# EAGLE design interface_dac_sma_feedback (EAGLE 7.2.0)
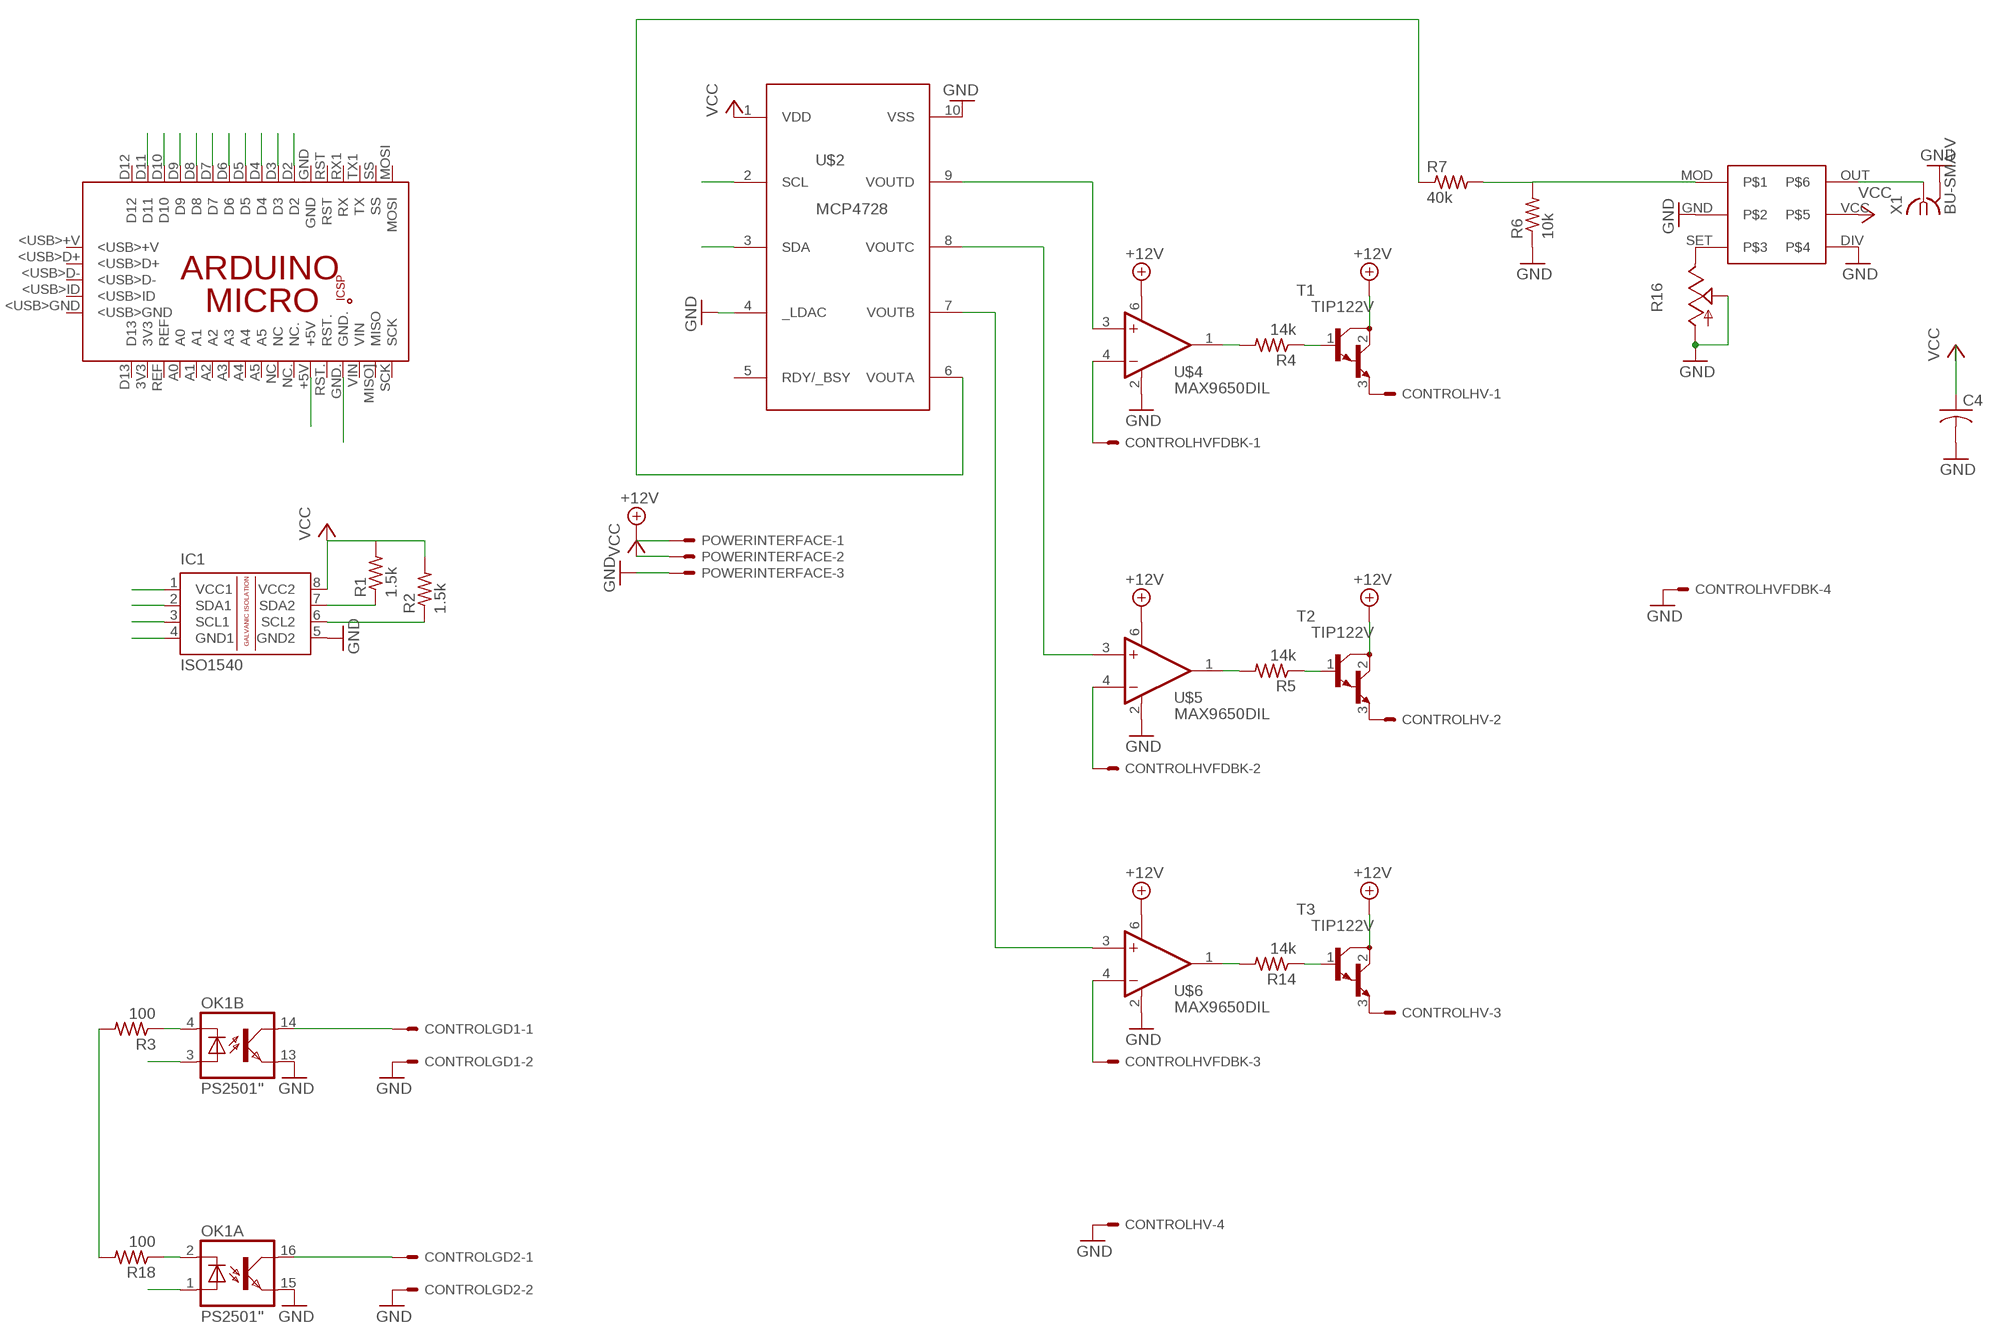
[diagram p0: schematic, sheet 1]

## Parts
C4  C-US075-063X106  [C075-063X106]
CONTROLGD1  KK-156-2  [KK-156-2]
CONTROLGD2  KK-156-2  [KK-156-2]
CONTROLHV  KK-156-4  [KK-156-4]
CONTROLHVFDBK  KK-156-4  [KK-156-4]
IC1  ISO1540  [DIL08]
OK1  PS2501"  [DIL16]
PCB1  ARDUINO_MICRO  [ARDUINO_MICRO]
POWERINTERFACE  KK-156-3  [KK-156-3]
R1  1.5k  R-US_0207/12  [0207/12]
R2  1.5k  R-US_0207/12  [0207/12]
R3  100  R-US_0207/12  [0207/12]
R4  14k  R-US_0207/12  [0207/12]
R5  14k  R-US_0207/12  [0207/12]
R6  10k  R-US_0207/12  [0207/12]
R7  40k  R-US_0207/12  [0207/12]
R14  14k  R-US_0207/12  [0207/12]
R16  TRIM_US-B90P  [SP19L]
R18  100  R-US_0207/12  [0207/12]
T1  TIP122V  [TO220V]
T2  TIP122V  [TO220V]
T3  TIP122V  [TO220V]
U$1  LTC6992  [DIL06]
U$2  MCP4728DIL  [DIL10]
U$4  MAX9650DIL  [DIL06-4]
U$5  MAX9650DIL  [DIL06-4]
U$6  MAX9650DIL  [DIL06-4]
X1  BU-SMA-V  [BU-SMA-V]

## Nets
+12V: POWERINTERFACE.1 T1.2(C) T2.2(C) T3.2(C) U$4.6(V+) U$5.6(V+) U$6.6(V+)
A+5: IC1.1(VCC1) PCB1.+5V
AGND: IC1.4(GND1) PCB1.GND. R3.2 R18.2
D4: PCB1.D4
D7: PCB1.D7
D8: PCB1.D8
D10: PCB1.D10
D11: PCB1.D11
ENSW1: CONTROLGD1.1 OK1.14(B:COL)
ENSW2: CONTROLGD2.1 OK1.16(A:COL)
GND: C4.2 CONTROLGD1.2 CONTROLGD2.2 CONTROLHV.4 CONTROLHVFDBK.4 IC1.5(GND2) OK1.13(B:EMI) OK1.15(A:EMI) POWERINTERFACE.3 R6.1 R16.A R16.S U$1.DIV U$1.GND U$2.4(_LDAC) U$2.10(VSS) U$4.2(V-) U$5.2(V-) U$6.2(V-) X1.2 X1.3 X1.4 X1.5
N$1: R7.1 U$2.6(VOUTA)
N$2: R6.2 R7.2 U$1.MOD
N$3: R4.1 T1.1(B)
N$4: CONTROLHV.1 T1.3(E)
N$5: R5.1 T2.1(B)
N$6: CONTROLHV.2 T2.3(E)
N$7: OK1.2(A:C) R18.1
N$8: CONTROLHVFDBK.1 U$4.4(-IN)
N$9: CONTROLHVFDBK.2 U$5.4(-IN)
N$10: OK1.4(B:C) R3.1
N$11: CONTROLHV.3 T3.3(E)
N$12: R16.E U$1.SET
N$13: U$1.OUT X1.1
N$14: CONTROLHVFDBK.3 U$6.4(-IN)
N$15: R14.1 T3.1(B)
N$16: U$2.9(VOUTD) U$4.3(+IN)
N$17: U$2.8(VOUTC) U$5.3(+IN)
N$18: U$2.7(VOUTB) U$6.3(+IN)
N$19: R4.2 U$4.1(OUT)
N$20: R5.2 U$5.1(OUT)
N$21: R14.2 U$6.1(OUT)
PWM5: PCB1.D5
PWM6: OK1.3(B:A) PCB1.D6
PWM9: OK1.1(A:A) PCB1.D9
SCL: IC1.3(SCL1) PCB1.D3
SCL_OUT: IC1.6(SCL2) R2.1 U$2.2(SCL)
SDA: IC1.2(SDA1) PCB1.D2
SDA_OUT: IC1.7(SDA2) R1.1 U$2.3(SDA)
VCC: C4.1 IC1.8(VCC2) POWERINTERFACE.2 R1.2 R2.2 U$1.VCC U$2.1(VDD)
Unconnected: OK1.5(C:A) OK1.6(C:C) OK1.7(D:A) OK1.8(D:C) OK1.9(D:EMI) OK1.10(D:COL) OK1.11(C:EMI) OK1.12(C:COL) PCB1.3V3 PCB1.5V PCB1.<USB>+V PCB1.<USB>D+ PCB1.<USB>D- PCB1.<USB>GND PCB1.<USB>ID PCB1.A0 PCB1.A1 PCB1.A2 PCB1.A3 PCB1.A4 PCB1.A5 PCB1.D12 PCB1.D13 PCB1.GND PCB1.GND_ PCB1.MISO. PCB1.MISO](MISO) PCB1.MOSI PCB1.MOSI. PCB1.NC PCB1.NC. PCB1.REF PCB1.RESET.. PCB1.RST PCB1.RST. PCB1.RX1(RX) PCB1.SCK PCB1.SCK. PCB1.SS PCB1.TX1(TX) PCB1.VIN U$2.5(RDY/_BSY)

## Library data of the parts
C4 = resistor:C-US: CAPACITOR, American symbol
CONTROLGD1 CONTROLGD2 = con-molex:KK-156-2: KK 156 HEADER Source: http://www.molex.com/pdm_docs/sd/026604100_sd.pdf; OC_FARNELL: unknown; OC_NEWARK: unknown
CONTROLHV CONTROLHVFDBK = con-molex:KK-156-4: KK 156 HEADER Source: http://www.molex.com/pdm_docs/sd/026604100_sd.pdf; OC_FARNELL: unknown; OC_NEWARK: unknown
IC1 = texas:ISO1540: ISOLATED CAN TRANSCEIVER Source: http://focus.ti.com/lit/ds/symlink/iso1050.pdf
OK1 = optocoupler:PS2501: SHARP OPTO COUPLER
PCB1 = E14_Arduino_published:ARDUINO_MICRO: Device for representing an Arduino Micro board with a footprint in an EAGLE design. Created by Dave Young for Element14. More EAGLE documentation at: http://www.element14.com/community/community/knode/cadsoft_eagle
POWERINTERFACE = con-molex:KK-156-3: KK 156 HEADER Source: http://www.molex.com/pdm_docs/sd/026604100_sd.pdf; OC_FARNELL: unknown; OC_NEWARK: unknown
R1 R2 R4-R7 R14 = resistor:R-US_: RESISTOR, American symbol
R3 R18 = rcl:R-US_: RESISTOR, American symbol
R16 = pot:TRIM_US-: POTENTIOMETER
T1-T3 = transistor-npn:TIP122*: NPN Darlington Transistor
U$1 = linear-technology:LTC6992
U$2 = microchip:MCP4728
U$4-U$6 = maxim:MAX9650
X1 = con-coax:BU-SMA-V: FEMALE SMA CONNECTOR Radiall distributor RS 112-3794; OC_FARNELL: unknown; OC_NEWARK: unknown

## Board
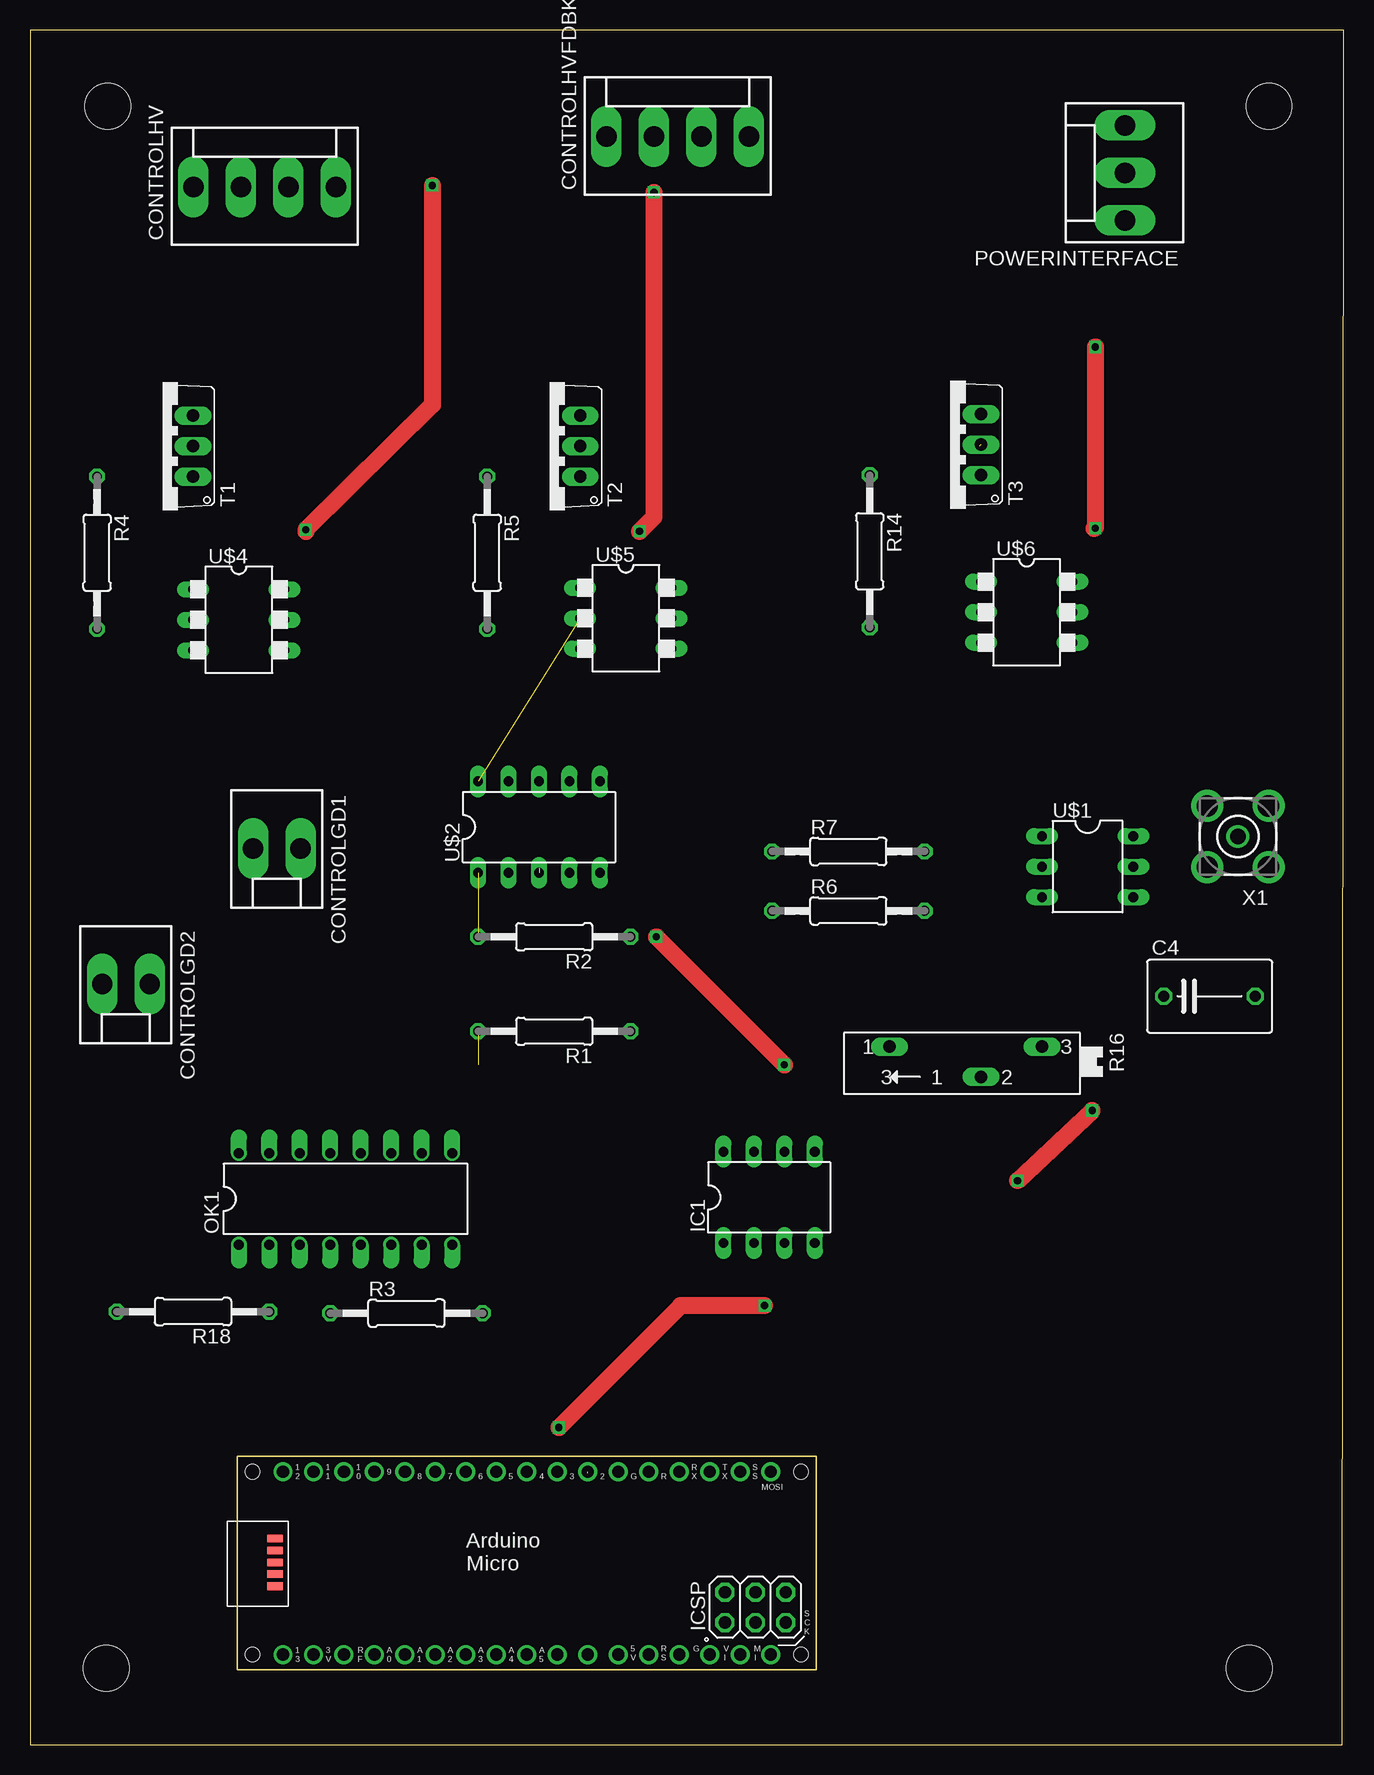
[diagram p1: board, top side]
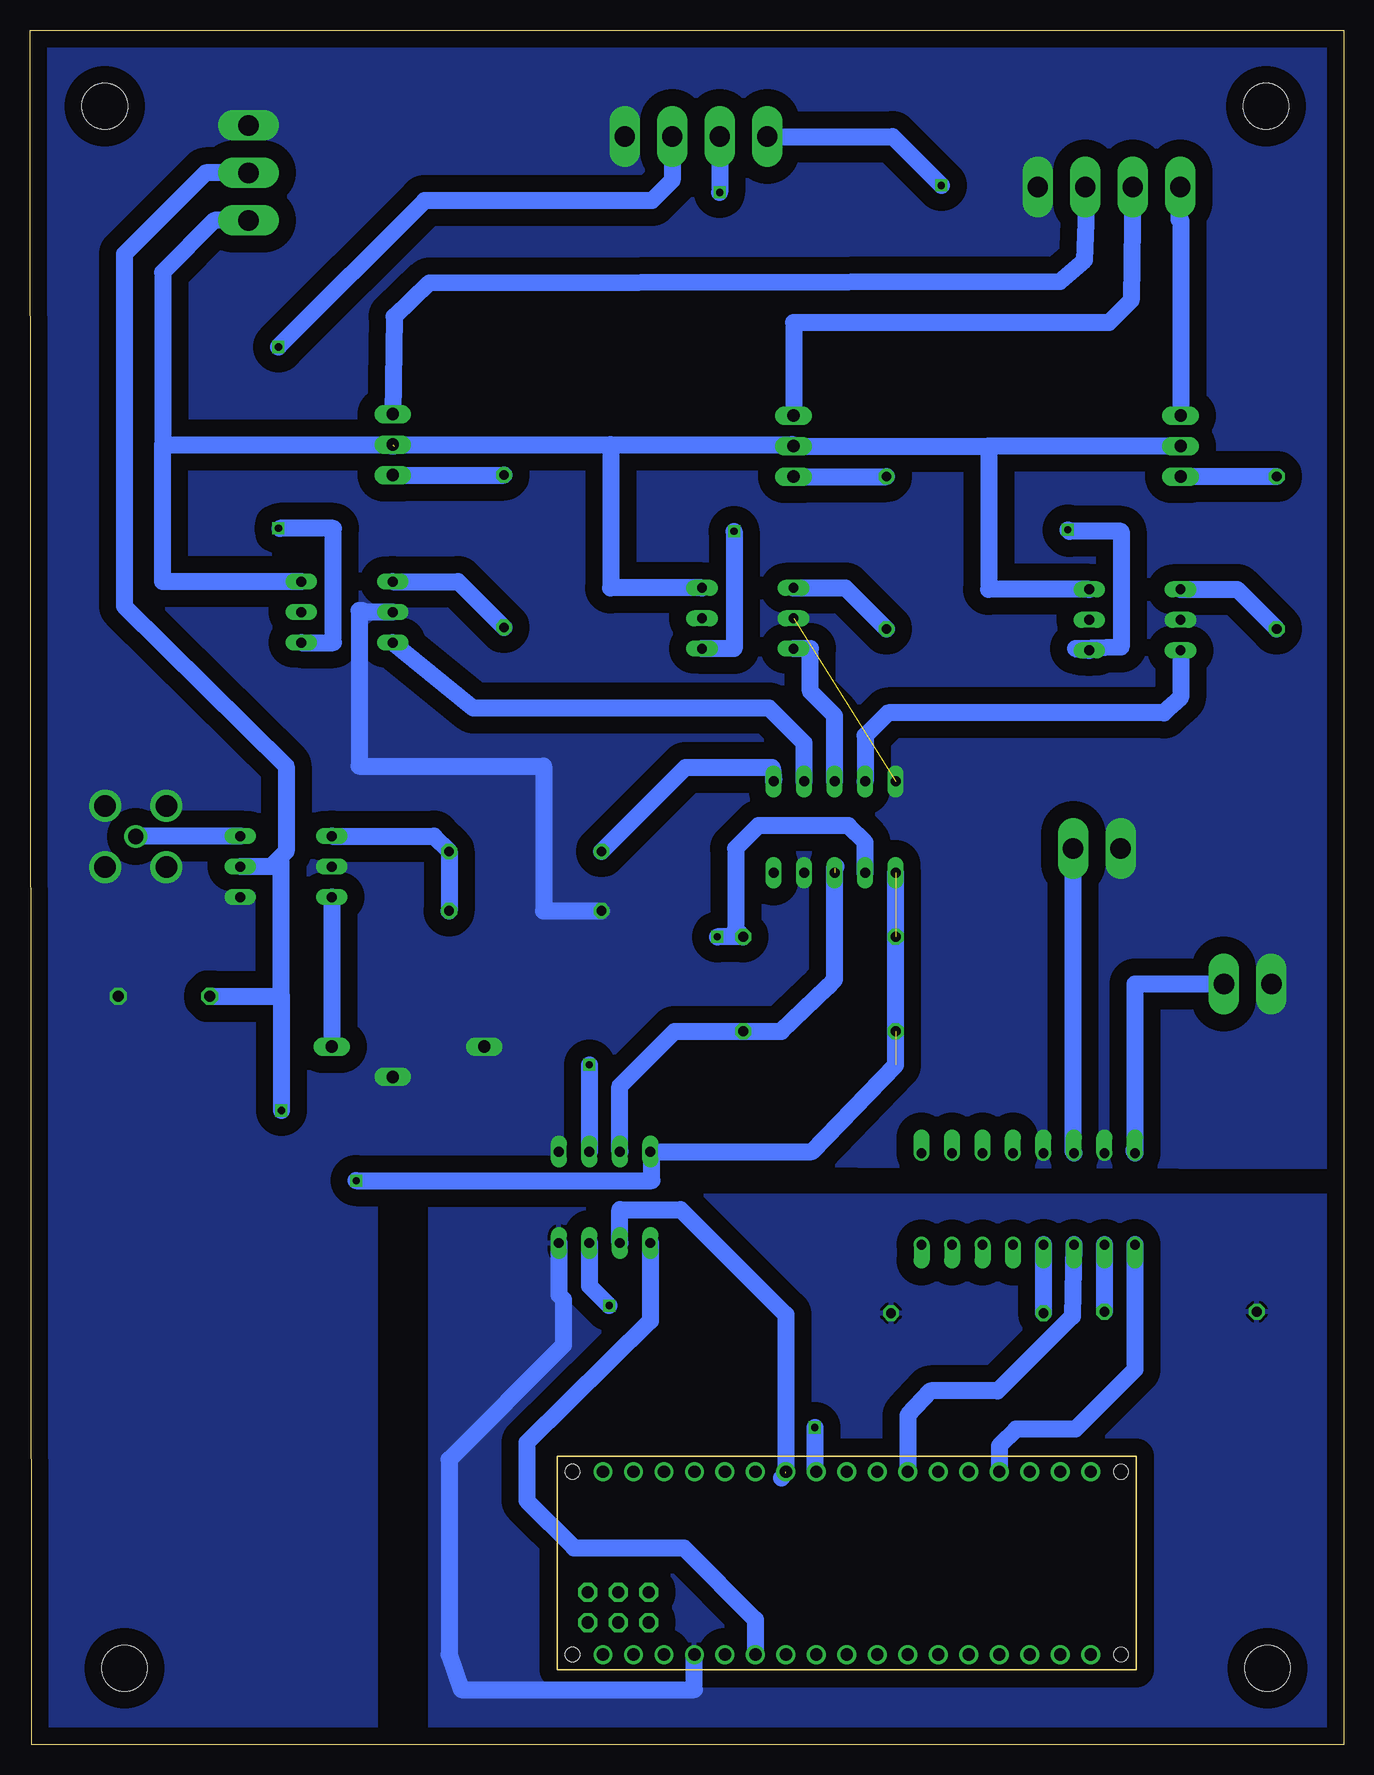
[diagram p2: board, bottom side, seen from below]

Size 109.47 x 142.88 mm. Coordinates in mm from the lower left corner, seen from the top.
Outline: 0,0 109.35,0 109.47,142.88 0,142.88 0,0
Copper layers (1*16): Top 0.035mm / dielectric 1.5mm / Bottom 0.035mm
Design rules "default": minimum track width 10mil, minimum drill 24mil, track to track 8mil, track to pad 8mil, pad to pad 8mil, via to via 8mil, smd to smd 8mil, copper to edge 40mil, drill to drill 8mil, minimum pad ring 10mil, minimum via ring 8mil, stop-mask expansion 4mil, vias tented up to drill 0mil, thermal gap 10mil
Holes 3.8 mm at 101.6,6.35 103.25,136.53 6.48,136.53 6.35,6.35

### Footprints (pad centres in the part's own frame; a part is rotated, then mirrored left to right if it is on the bottom)
C075-063X106 = drill 0.914 octagon: 1 -3.81,0; 2 3.81,0
KK-156-2 = drill 1.7 pad 2.184 long: 1 -1.98,0; 2 1.98,0
KK-156-4 = drill 1.7 pad 2.184 long: 1 -5.94,0; 2 -1.98,0; 3 1.98,0; 4 5.94,0
DIL08 = drill 0.813 long: 1 -3.81,-3.81; 2 -1.27,-3.81; 3 1.27,-3.81; 4 3.81,-3.81; 5 3.81,3.81; 6 1.27,3.81; 7 -1.27,3.81; 8 -3.81,3.81
DIL16 = drill 0.813 offset: 1 -8.89,-3.81; 2 -6.35,-3.81; 3 -3.81,-3.81; 4 -1.27,-3.81; 5 1.27,-3.81; 6 3.81,-3.81; 7 6.35,-3.81; 8 8.89,-3.81; 9 8.89,3.81; 10 6.35,3.81; 11 3.81,3.81; 12 1.27,3.81; 13 -1.27,3.81; 14 -3.81,3.81; 15 -6.35,3.81; 16 -8.89,3.81
ARDUINO_MICRO = drill 1.016 pad 1.575: 3V3 6.35,1.27; +5V 31.75,1.27; A0 11.43,1.27; A1 13.97,1.27; A2 16.51,1.27; A3 19.05,1.27; A4 21.59,1.27; A5 24.13,1.27; D2 29.21,16.51; D3 26.67,16.51; D4 24.13,16.51; D5 21.59,16.51; D6 19.05,16.51; D7 16.51,16.51; D8 13.97,16.51; D9 11.43,16.51; D10 8.89,16.51; D11 6.35,16.51; D12 3.81,16.51; D13 3.81,1.27; GND 31.75,16.51; GND. 36.83,1.27; MISO] 41.91,1.27; MOSI 44.45,16.51; NC 26.67,1.27; NC. 29.21,1.27; REF 8.89,1.27; RST 34.29,16.51; RST. 34.29,1.27; RX1 36.83,16.51; SCK 44.45,1.27; SS 41.91,16.51; TX1 39.37,16.51; VIN 39.37,1.27 | drill 1.016 pad 1.575 octagon: 5V 40.64,6.477; GND_ 45.72,6.477; MISO. 40.64,3.937; MOSI. 43.18,6.477; RESET.. 45.72,3.937; SCK. 43.18,3.937 | smd 1.27 x 0.635: <USB>+V 3.15,10.947; <USB>D+ 3.15,9.957; <USB>D- 3.15,8.941; <USB>GND 3.15,6.96; <USB>ID 3.15,7.976 | hole 1.2: 1.27,1.27; 1.27,16.51; 46.99,16.51; 46.99,1.27
KK-156-3 = drill 1.7 pad 2.184 long: 1 -3.96,0; 2 0,0; 3 3.96,0
0207/12 = drill 0.813 octagon: 1 -6.35,0; 2 6.35,0
SP19L = drill 1.016 long: A 5.715,-1.27; E -6.985,-1.27; S -1.905,1.27
TO220V = drill 1.016 long: 1 -2.54,-2.54; 2 0,-2.54; 3 2.54,-2.54
DIL06 = drill 0.813 long: DIV 2.54,3.81; GND 0,-3.81; MOD -2.54,-3.81; OUT -2.54,3.81; SET 2.54,-3.81; VCC 0,3.81
DIL10 = drill 0.813 long: 1 -5.08,-3.81; 2 -2.54,-3.81; 3 0,-3.81; 4 2.54,-3.81; 5 5.08,-3.81; 6 5.08,3.81; 7 2.54,3.81; 8 0,3.81; 9 -2.54,3.81; 10 -5.08,3.81
DIL06-4 = drill 0.813 long: 1 -2.54,-3.81; 2 0,-3.81; 3 2.54,-3.81; 4 2.54,3.81; 5 0,3.81; 6 -2.54,3.81
BU-SMA-V = drill 1.27: 1 0,0 | drill 1.778: 2 -2.55,2.55; 3 2.55,2.55; 4 2.55,-2.55; 5 -2.55,-2.55

### Placement (x,y rotation side)
C4  98.3,62.36 0 top
CONTROLGD1  20.57,74.68 180 top
CONTROLGD2  8,63.37 180 top
CONTROLHV  19.56,129.79 0 top
CONTROLHVFDBK  53.98,133.99 0 top
IC1  61.59,45.59 0 top
OK1  26.29,45.47 0 top
PCB1  17.27,6.22 0 top
POWERINTERFACE  91.26,130.96 90 top
R1  43.69,59.44 180 top
R2  43.69,67.31 180 top
R3  31.37,35.94 0 top
R4  5.59,99.31 270 top
R5  38.1,99.31 270 top
R6  68.2,69.47 0 top
R7  68.2,74.42 0 top
R14  69.98,99.44 270 top
R16  77.34,56.9 180 top
R18  13.59,36.07 180 top
T1  11.05,108.2 90 top
T2  43.31,108.2 90 top
T3  76.71,108.33 90 top
U$1  88.14,73.15 270 top
U$2  42.42,76.45 0 top
U$4  17.4,93.73 270 top
U$5  49.66,93.85 270 top
U$6  83.06,94.36 270 top
X1  100.66,75.67 180 top

### Tracks (layer width: path | path; a pad name or v marks a point on that pad's centre or on a via)
+12V  (1 unrouted)
  Bottom 1.422: U$4.6 29.59,96.27 29.59,108.2 | U$5.6 61.09,96.39 61.09,108.33 | 29.59,108.2 T2.2 45.97,108.33 61.09,108.33 | U$6.6 98.42,96.9 98.42,108.33 | T1.2 29.59,108.2 | T3.2 61.09,108.33 | 98.42,108.33 98.42,122.68 94.11,127 POWERINTERFACE.1 | 98.42,108.33 80.01,108.33 79.12,108.2
A+5
  Bottom 1.422: IC1.1 57.78,35.31 68.07,25.15 68.07,20.32 64.14,16.38 54.99,16.38 49.02,10.41 PCB1.+5V
AGND
  Bottom 1.422: IC1.4 65.41,37.47 65.02,37.08 65.02,33.27 74.55,23.75 74.55,7.49 73.53,4.57 54.1,4.57 PCB1.GND.
  pour Bottom (isolate 1.422): -0.13,0.13 76.07,0.13 76.07,45.72 0,45.72
ENSW1
  Bottom 1.422: OK1.14 22.55,49.53 CONTROLGD1.1
ENSW2
  Bottom 1.422: 17.47,49.53 OK1.16 17.4,63.37 CONTROLGD2.1
GND  (1 unrouted)
  Bottom 1.422: U$6.2 81.79,94.36 81.79,94.49 82.04,94.49 82.04,81.53 66.67,81.53 66.67,69.47 R6.1
  pour Bottom (isolate 1.422, no thermals): 0.13,142.75 109.35,142.75 109.22,0 80.64,0.13 80.64,48.39 0.38,48.13
N$1
  Bottom 1.422: U$2.6 47.62,81.41 54.86,81.41 R7.1
N$2
  Bottom 1.422: U$1.MOD 75.82,75.69 R7.2 R6.2
N$3
  Bottom 1.422: R4.1 T1.1
N$4
  Bottom 1.422: CONTROLHV.1 13.72,127.1 13.59,127.1 T1.3
N$5
  Bottom 1.422: T2.1 R5.1
N$6
  Bottom 1.422: CONTROLHV.2 17.7,120.34 19.56,118.49 45.85,118.49 T2.3
N$7
  Bottom 1.422: OK1.2 R18.1
N$8  (via drill 0.6)
  Top 1.422: v33.53,129.92 33.53,111.63 v22.99,101.22 22.99,101.09
  Bottom 1.422: U$4.4 22.35,91.31 18.54,91.44 18.54,101.09 22.86,101.09 v22.99,101.22 | CONTROLHVFDBK.1 37.59,133.99 v33.53,129.92
N$9  (via drill 0.6)
  Top 1.422: v51.99,129.34 51.99,102.29 v50.8,101.09
  Bottom 1.422: U$5.4 50.8,91.31 v50.8,101.09 | CONTROLHVFDBK.2 v51.99,129.34
N$10
  Bottom 1.422: OK1.4 R3.1
N$11
  Bottom 1.422: CONTROLHV.3 21.46,126.82 21.59,123.7 23.62,121.92 76.2,121.79 79.12,119 T3.3
N$12
  Bottom 1.422: U$1.SET R16.E
N$13
  Bottom 1.422: U$1.OUT 100.64,75.69 X1.1
N$14  (via drill 0.6)  (1 unrouted)
  Top 1.422: v88.77,116.46 88.77,101.47 88.65,101.35
  Bottom 1.422: U$6.4 84.2,91.82 84.2,101.35 88.65,101.35 | CONTROLHVFDBK.3 55.95,130.35 57.66,128.65 76.58,128.65 v88.77,116.46
N$15
  Bottom 1.422: T3.1 R14.1
N$16
  Bottom 1.422: U$4.3 13.59,87.25 14.99,85.98 37.97,85.98 39.88,84.07 U$2.9
N$17
  Bottom 1.422: U$2.8 42.42,85.72 44.45,87.76 44.45,91.31 U$5.3
N$18
  Bottom 1.422: U$2.7 44.96,83.44 47.88,86.36 72.52,86.36 U$6.3
N$19
  Bottom 1.422: U$4.1 8.89,96.27 R4.2
N$20
  Bottom 1.422: U$5.1 41.53,96.39 R5.2
N$21
  Bottom 1.422: U$6.1 73.79,96.9 R14.2
N$22  (via drill 0.6)
  other vias: 88.77,101.35
PWM6
  Bottom 1.422: OK1.3 22.61,35.69 28.83,29.46 34.42,29.46 36.32,27.43 PCB1.D6
PWM9
  Bottom 1.422: OK1.1 17.4,31.24 22.35,26.29 27.3,26.29 28.7,24.89 PCB1.D9
SCL  (via drill 0.6)
  Top 1.422: v61.21,36.58 54.23,36.58 v44.07,26.42
  Bottom 1.422: IC1.3 62.87,38.23 v61.21,36.58 | v44.07,26.42 44.07,22.86 PCB1.D3
SCL_OUT  (via drill 0.6)
  Top 1.422: v52.2,67.31 v62.87,56.64
  Bottom 1.422: U$2.2 39.88,75.18 41.27,76.58 48.77,76.58 50.67,74.68 50.67,67.94 R2.1 v52.2,67.31 | v62.87,56.64 IC1.6
SDA  (1 unrouted)
  Bottom 1.422: IC1.2 60.33,44.58 55.24,44.58 46.48,35.81 46.48,22.61 46.86,22.23
SDA_OUT  (1 unrouted)
  Bottom 1.422: IC1.7 60.33,54.86 55.75,59.44 R1.1 46.86,59.44 43.05,63.12 42.42,63.75 42.42,73.03 42.29,73.15
VCC  (via drill 0.6)  (2 unrouted)
  Top 1.422: v88.52,52.83 v82.3,46.99
  Bottom 1.422: 88.52,74.04 88.14,74.42 88.14,81.53 101.6,94.87 101.6,124.21 94.84,130.96 POWERINTERFACE.2 | 88.52,74.04 89.41,73.15 U$1.VCC | C4.1 88.52,62.36 | 88.52,62.36 88.52,74.04 | U$2.1 37.34,56.64 44.32,49.4 IC1.8 57.66,49.28 57.66,46.99 v82.3,46.99 | 88.52,62.36 v88.52,52.83